# EAGLE design voiture TRR (EAGLE 6.1)
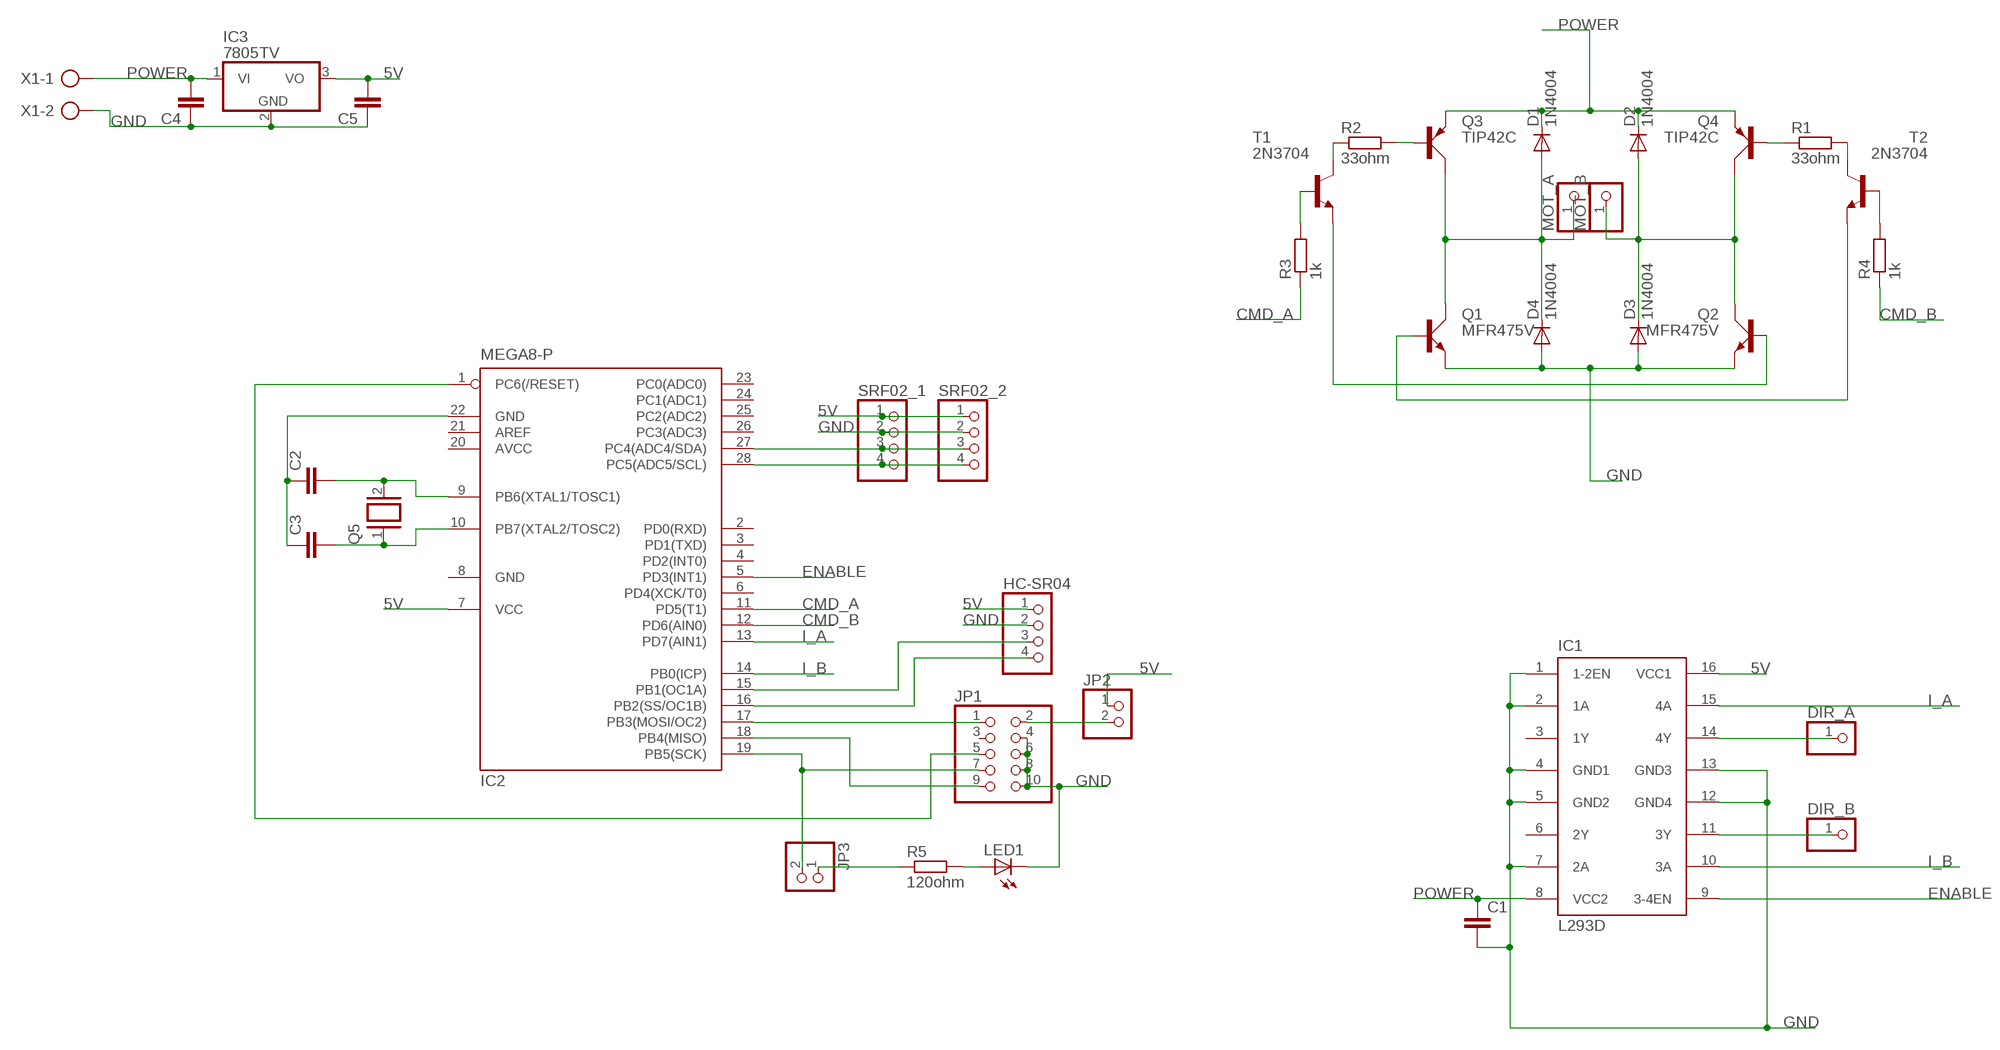
[diagram p0: schematic, sheet 1]

## Parts
C1  C-EU025-050X050  [C025-050X050]
C2  C5/2.5  [C5B2.5]
C3  C5/2.5  [C5B2.5]
C4  C5/2.5  [C5B2.5]
C5  C5/2.5  [C5B2.5]
D1  1N4004  [DO41-10]
D2  1N4004  [DO41-10]
D3  1N4004  [DO41-10]
D4  1N4004  [DO41-10]
DIR_A  PINHD-1X1  [1X01]
DIR_B  PINHD-1X1  [1X01]
HC-SR04  PINHD-1X4  [1X04]
IC1  L293D  [DIL16]
IC2  MEGA8-P  [DIL28-3]
IC3  7805TV  [TO220V]
JP1  PINHD-2X5  [2X05]
JP2  PINHD-1X2  [1X02]
JP3  PINHD-1X2  [1X02]
LED1  LED5MM  [LED5MM]
MOT_A  PINHD-1X1  [1X01]
MOT_B  PINHD-1X1  [1X01]
Q1  MFR475V  [TO220AV]
Q2  MFR475V  [TO220AV]
Q3  TIP42C  [TO220AV]
Q4  TIP42C  [TO220AV]
Q5  XTAL/S  [QS]
R1  33ohm  R-EU_0204/7  [0204/7]
R2  33ohm  R-EU_0204/7  [0204/7]
R3  1k  R-EU_0204/7  [0204/7]
R4  1k  R-EU_0204/7  [0204/7]
R5  120ohm  R-EU_0204/7  [0204/7]
SRF02_1  PINHD-1X4  [1X04]
SRF02_2  PINHD-1X4  [1X04]
T1  2N3704  [TO92]
T2  2N3704  [TO92]
X1  AK300/2  [AK300/2]

## Nets
5V: C5.2 HC-SR04.1 IC1.16(VCC1) IC2.7(VCC) IC3.3(VO) JP2.1 SRF02_1.1 SRF02_2.1
CMD_A: IC2.11(PD5(T1)) R3.1
CMD_B: IC2.12(PD6(AIN0)) R4.1
ENABLE: IC1.9(3-4EN) IC2.5(PD3(INT1))
GND: C1.2 C2.1 C3.1 C4.1 C5.1 D3.A D4.A HC-SR04.2 IC1.1(1-2EN) IC1.2(1A) IC1.4(GND1) IC1.5(GND2) IC1.7(2A) IC1.12(GND4) IC1.13(GND3) IC2.22(GND) IC3.2(GND) JP1.4 JP1.6 JP1.8 JP1.10 LED1.K(C) Q1.E Q2.E SRF02_1.2 SRF02_2.2 X1.2
I_A: IC1.15(4A) IC2.13(PD7(AIN1))
I_B: IC1.10(3A) IC2.14(PB0(ICP))
N$1: D1.A D4.C MOT_A.1 Q1.C Q3.C
N$2: Q3.B R2.2
N$3: DIR_A.1 IC1.14(4Y)
N$4: DIR_B.1 IC1.11(3Y)
N$5: R2.1 T1.2(C)
N$6: D2.A D3.C MOT_B.1 Q2.C Q4.C
N$7: Q2.B T1.3(E)
N$8: Q4.B R1.1
N$9: R1.2 T2.2(C)
N$10: Q1.B T2.3(E)
N$11: R4.2 T2.1(B)
N$12: R3.2 T1.1(B)
N$13: C3.2 IC2.10(PB7(XTAL2/TOSC2)) Q5.1
N$14: C2.2 IC2.9(PB6(XTAL1/TOSC1)) Q5.2
N$15: IC2.17(PB3(MOSI/OC2)) JP1.1
N$16: IC2.1(PC6(/RESET)) JP1.5
N$17: IC2.19(PB5(SCK)) JP1.7 JP3.2
N$18: IC2.18(PB4(MISO)) JP1.9
N$19: JP3.1 R5.1
N$20: JP1.2 JP2.2
N$21: LED1.A R5.2
N$22: IC2.27(PC4(ADC4/SDA)) SRF02_1.3 SRF02_2.3
N$23: IC2.28(PC5(ADC5/SCL)) SRF02_1.4 SRF02_2.4
N$24: HC-SR04.3 IC2.15(PB1(OC1A))
N$25: HC-SR04.4 IC2.16(PB2(SS/OC1B))
POWER: C1.1 C4.2 D1.C D2.C IC1.8(VCC2) IC3.1(VI) Q3.E Q4.E X1.1
Unconnected: IC1.3(1Y) IC1.6(2Y) IC2.2(PD0(RXD)) IC2.3(PD1(TXD)) IC2.4(PD2(INT0)) IC2.6(PD4(XCK/T0)) IC2.21(AREF) IC2.23(PC0(ADC0)) IC2.24(PC1(ADC1)) IC2.25(PC2(ADC2)) IC2.26(PC3(ADC3)) JP1.3

## Power pins joined to a net without a drawn wire
5V: IC2.20(AVCC)
GND: IC2.8(GND)

## Library data of the parts
C1 = rcl:C-EU: CAPACITOR, European symbol
C2-C5 = capacitor-wima:C: CAPACITOR naming: grid - package width
D1-D4 = diode:1N4004: DIODE general purpose rectifier, 1 A
DIR_A DIR_B MOT_A MOT_B = pinhead:PINHD-1X1: PIN HEADER
HC-SR04 SRF02_1 SRF02_2 = pinhead:PINHD-1X4: PIN HEADER
IC1 = st-microelectronics:L293D: PUSH-PULL 4 CHANNEL DRIVER; MPN: L293D; OC_FARNELL: 9589619; OC_NEWARK: 56P8249
IC2 = atmel:MEGA8-P: MICROCONTROLLER 8 Kbytes FLASH, 1 kbytes SRAM, 512 bytes EEPROM, USART, 4-channel 10 bit ADC, 2-channel 8 bit ADC Pin compatible with Atmega48, ATMega88, ATMega168 Source: avr.lbr; OC_FARNELL: unknown; OC_NEWARK: unknown
IC3 = linear:78*: Positive VOLTAGE REGULATOR Source: http://cache.national.com/ds/LM/LM78L05.pdf http://www.fairchildsemi.com/ds/LM/LM7805.pdf
JP1 = pinhead:PINHD-2X5: PIN HEADER
JP2 JP3 = pinhead:PINHD-1X2: PIN HEADER
LED1 = led:LED: LED OSRAM: - CHIPLED LG R971, LG N971, LY N971, LG Q971, LY Q971, LO R971, LY R971 LH N974, LH R974 LS Q976, LO Q976, LY Q976 LO Q996 - Hyper CHIPLED LW Q18S LB Q993, LB Q99A, LB R99A - SideLED LS A670, LO A670, LY A670, LG A670, LP A670 LB A673, LV A673, LT A673, LW A673 LH A674 LY A675 LS A676, LA A676, LO A676, LY A676, LW A676 LS A679, LY A679, LG A679 - Hyper Micro SIDELED® LS Y876, LA Y876, LO Y876, LY Y876 LT Y87S - SmartLED LW L88C, LW L88S LB L89C, LB L89S, LG L890 LS L89K, LO L89K, LY L89K LS L896, LA L896, LO L896, LY L896 - TOPLED LS T670, LO T670, LY T670, LG T670, LP T670 LSG T670, LSP T670, LSY T670, LOP T670, LYG T670 LG T671, LOG T671, LSG T671 LB T673, LV T673, LT T673, LW T673 LH T674 LS T676, LA T676, LO T676, LY T676, LB T676, LH T676, LSB T676, LW T676 LB T67C, LV T67C, LT T67C, LS T67K, LO T67K, LY T67K, LW E67C LS E67B, LA E67B, LO E67B, LY E67B, LB E67C, LV E67C, LT E67C LW T67C LS T679, LY T679, LG T679 LS T770, LO T770, LY T770, LG T770, LP T770 LB T773, LV T773, LT T773, LW T773 LH T774 LS E675, LA E675, LY E675, LS T675 LS T776, LA T776, LO T776, LY T776, LB T776 LHGB T686 LT T68C, LB T68C - Hyper Mini TOPLED® LB M676 - Mini TOPLED Santana® LG M470 LS M47K, LO M47K, LY M47K Source: http://www.osram.convergy.de LUXEON: - LUMILED® LXK2-PW12-R00, LXK2-PW12-S00, LXK2-PW14-U00, LXK2-PW14-V00 LXK2-PM12-R00, LXK2-PM12-S00, LXK2-PM14-U00 LXK2-PE12-Q00, LXK2-PE12-R00, LXK2-PE12-S00, LXK2-PE14-T00, LXK2-PE14-U00 LXK2-PB12-K00, LXK2-PB12-L00, LXK2-PB12-M00, LXK2-PB14-N00, LXK2-PB14-P00, LXK2-PB14-Q00 LXK2-PR12-L00, LXK2-PR12-M00, LXK2-PR14-Q00, LXK2-PR14-R00 LXK2-PD12-Q00, LXK2-PD12-R00, LXK2-PD12-S00 LXK2-PH12-R00, LXK2-PH12-S00 LXK2-PL12-P00, LXK2-PL12-Q00, LXK2-PL12-R00 Source: www.luxeon.com KINGBRIGHT: KA-3528ASYC Source: www.kingbright.com
Q1 Q2 = transistor-power:MFR4*: NPN RF Power Transistor Source: Motorola - MRF475.pdf
Q3 Q4 = transistor-power:TIP42C: PNP TRANSISTOR
Q5 = special:XTAL/S: CRYSTAL
R1-R5 = resistor:R-EU_: RESISTOR, European symbol
T1 T2 = transistor:2N3704: NPN TRANSISTOR
X1 = con-ptr500:AK300/2: CONNECTOR; OC_FARNELL: unknown; OC_NEWARK: unknown

## Board
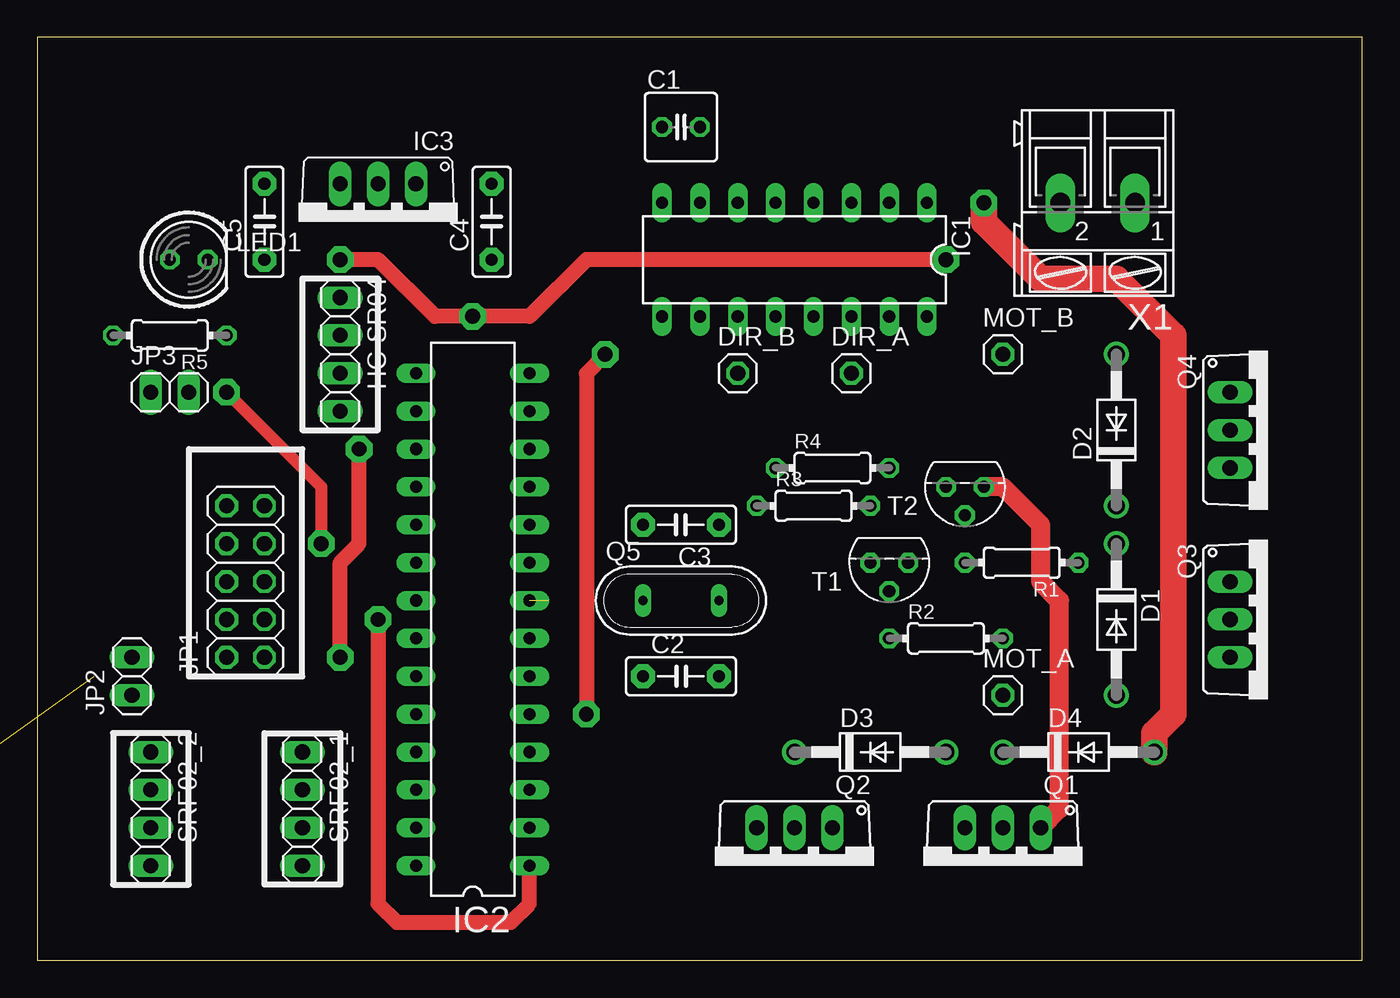
[diagram p1: board, top side]
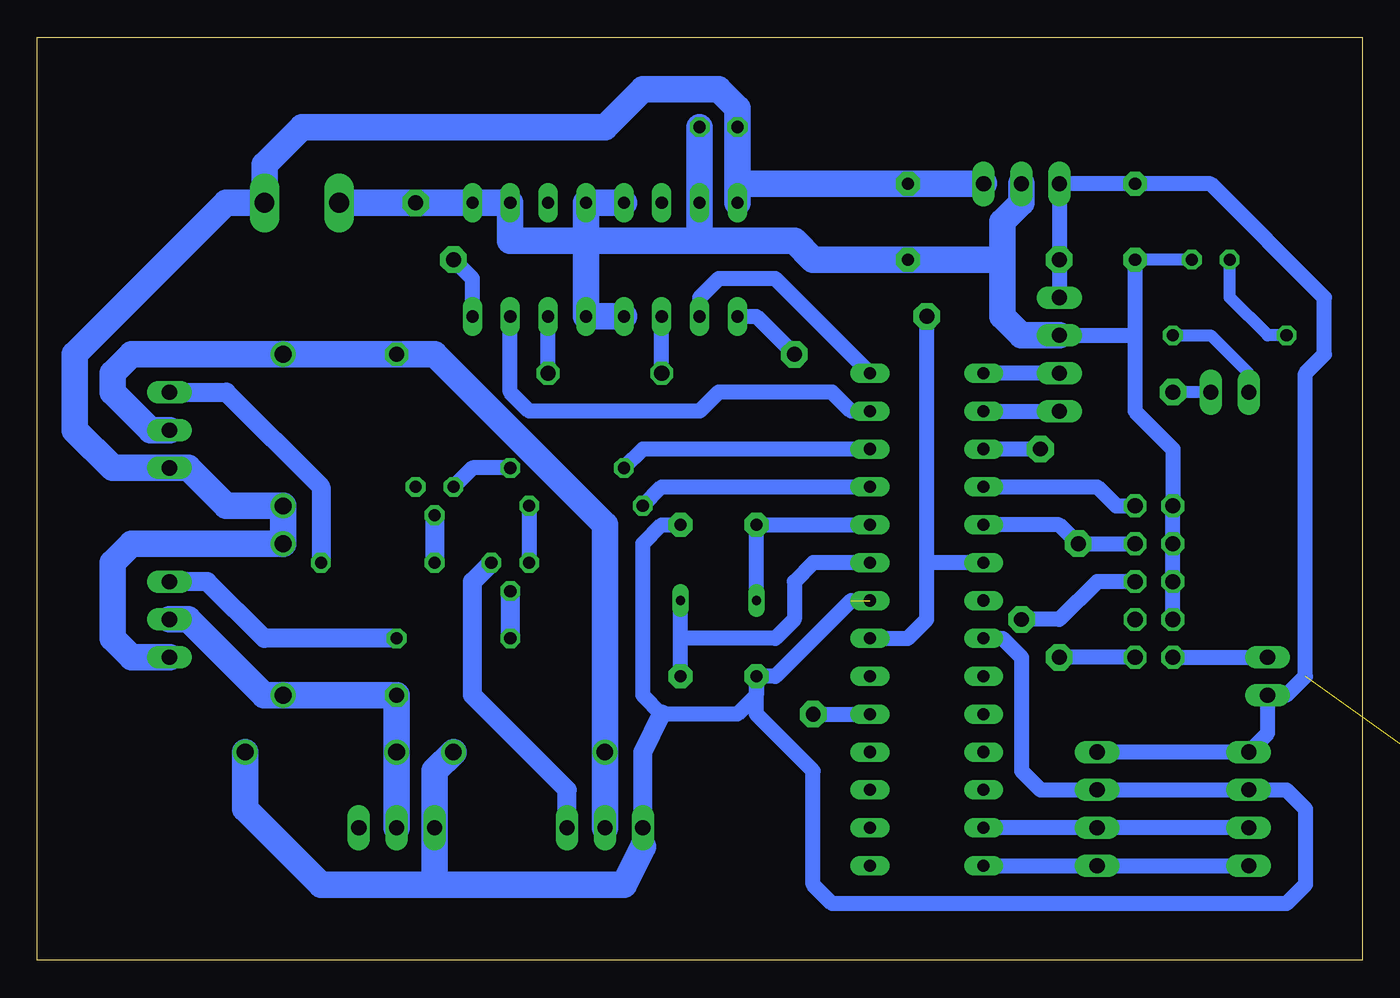
[diagram p2: board, bottom side, seen from below]

Size 88.88 x 61.9 mm. Coordinates in mm from the lower left corner, seen from the top.
Outline: 0,0 88.88,0 88.88,61.9 0,61.9 0,0
Copper layers (1*16): Top 0.035mm / dielectric 1.5mm / Bottom 0.035mm
Design rules: minimum track width 10mil, minimum drill 24mil, track to track 8mil, track to pad 8mil, pad to pad 8mil, via to via 8mil, smd to smd 8mil, copper to edge 40mil, drill to drill 8mil, minimum pad ring 10mil, minimum via ring 8mil, stop-mask expansion 4mil, vias tented up to drill 0mil, thermal gap 10mil

### Footprints (pad centres in the part's own frame; a part is rotated, then mirrored left to right if it is on the bottom)
C025-050X050 = drill 0.813 octagon: 1 -1.27,0; 2 1.27,0
C5B2.5 = drill 0.813 pad 1.6 octagon: 1 -2.54,0; 2 2.54,0
DO41-10 = drill 1.118: A 5.08,0; C -5.08,0
1X01 = drill 1.016 octagon: 1 0,0
1X04 = drill 1.016 long: 1 -3.81,0; 2 -1.27,0; 3 1.27,0; 4 3.81,0
DIL16 = drill 0.813 long: 1 -8.89,-3.81; 2 -6.35,-3.81; 3 -3.81,-3.81; 4 -1.27,-3.81; 5 1.27,-3.81; 6 3.81,-3.81; 7 6.35,-3.81; 8 8.89,-3.81; 9 8.89,3.81; 10 6.35,3.81; 11 3.81,3.81; 12 1.27,3.81; 13 -1.27,3.81; 14 -3.81,3.81; 15 -6.35,3.81; 16 -8.89,3.81
DIL28-3 = drill 0.813 long: 1 -16.51,-3.81; 2 -13.97,-3.81; 3 -11.43,-3.81; 4 -8.89,-3.81; 5 -6.35,-3.81; 6 -3.81,-3.81; 7 -1.27,-3.81; 8 1.27,-3.81; 9 3.81,-3.81; 10 6.35,-3.81; 11 8.89,-3.81; 12 11.43,-3.81; 13 13.97,-3.81; 14 16.51,-3.81; 15 16.51,3.81; 16 13.97,3.81; 17 11.43,3.81; 18 8.89,3.81; 19 6.35,3.81; 20 3.81,3.81; 21 1.27,3.81; 22 -1.27,3.81; 23 -3.81,3.81; 24 -6.35,3.81; 25 -8.89,3.81; 26 -11.43,3.81; 27 -13.97,3.81; 28 -16.51,3.81
TO220V = drill 1.016 long: 1 -2.54,-2.54; 2 0,-2.54; 3 2.54,-2.54
2X05 = drill 1.016 octagon: 1 -5.08,-1.27; 2 -5.08,1.27; 3 -2.54,-1.27; 4 -2.54,1.27; 5 0,-1.27; 6 0,1.27; 7 2.54,-1.27; 8 2.54,1.27; 9 5.08,-1.27; 10 5.08,1.27
1X02 = drill 1.016 long: 1 -1.27,0; 2 1.27,0
LED5MM = drill 0.813 octagon: A -1.27,0; K 1.27,0
TO220AV = drill 1.016 long: B -2.54,-2.54; C 0,-2.54; E 2.54,-2.54
QS = drill 0.61 long: 1 -2.54,0; 2 2.54,0
0204/7 = drill 0.813 octagon: 1 -3.81,0; 2 3.81,0
TO92 = drill 0.813 octagon: 1 1.27,0; 2 0,1.905; 3 -1.27,0
AK300/2 = drill 1.321 long: 1 -2.515,0; 2 2.489,0

### Placement (x,y rotation side)
C1  43.18,55.88 0 top
C2  43.18,19.05 0 top
C3  43.18,29.21 180 top
C4  30.48,49.53 90 top
C5  15.24,49.53 90 top
D1  72.39,22.86 270 top
D2  72.39,35.56 90 top
D3  55.88,13.97 0 top
D4  69.85,13.97 0 top
DIR_A  54.61,39.37 0 top
DIR_B  46.99,39.37 0 top
HC-SR04  20.32,40.64 270 top
IC1  50.8,46.99 180 top
IC2  29.21,22.86 90 top
IC3  22.86,49.53 180 top
JP1  13.97,25.4 90 top
JP2  6.35,19.05 90 top
JP3  8.89,38.1 0 top
LED1  10.16,46.99 0 top
MOT_A  64.77,17.78 0 top
MOT_B  64.77,40.64 0 top
Q1  64.77,6.35 180 top
Q2  50.8,6.35 180 top
Q3  82.55,22.86 270 top
Q4  82.55,35.56 270 top
Q5  43.18,24.13 0 top
R1  66.04,26.67 180 top
R2  60.96,21.59 0 top
R3  52.07,30.48 0 top
R4  53.34,33.02 0 top
R5  8.89,41.91 180 top
SRF02_1  17.78,10.16 270 top
SRF02_2  7.62,10.16 270 top
T1  57.15,26.67 180 top
T2  62.23,31.75 180 top
X1  71.12,50.8 180 top

### Tracks (layer width: path | path; a pad name or v marks a point on that pad's centre or on a via)
5V  (via drill 1 pad 1.78)  (1 unrouted)
  Top 1.016: v60.96,46.99 36.83,46.99 33.02,43.18 v29.21,43.18 26.67,43.18 22.86,46.99 v20.32,46.99
  Bottom 1.016: SRF02_1.1 SRF02_2.1 6.35,15.24 JP2.1 5.08,17.78 3.81,19.05 3.81,39.37 2.54,40.64 2.54,44.45 10.16,52.07 C5.2 IC3.3 v20.32,46.99 HC-SR04.1 | IC1.16 59.69,45.72 v60.96,46.99 | IC2.7 30.48,21.59 29.21,22.86 29.21,26.67 | 29.21,26.67 v29.21,43.18 | IC2.20 29.21,26.67
  other vias: -22.86,0
CMD_A
  Bottom 1.016: R3.1 46.99,31.75 IC2.11
CMD_B
  Bottom 1.016: IC2.12 48.26,34.29 R4.1
ENABLE  (via drill 1 pad 1.78)
  Top 1.016: v38.1,40.64 36.83,39.37 v36.83,16.51
  Bottom 1.016: IC1.9 40.64,43.18 v38.1,40.64 | v36.83,16.51 IC2.5
GND  (via drill 1 pad 1.78)  (1 unrouted)
  Top 1.778: D4.A 74.93,15.24 76.2,16.51 76.2,41.91 72.39,45.72 67.31,45.72 63.5,49.53 v63.5,50.8
  Bottom 0.813: LED1.K C5.1
  Bottom 1.016: 34.29,24.13 39.37,19.05 C2.1 | JP1.4 JP1.6 JP1.8 JP1.10 12.7,34.29 15.24,36.83 15.24,41.91 | C5.1 15.24,41.91 | HC-SR04.2 15.24,41.91 | IC2.22 24.13,21.59 22.86,20.32 22.86,12.7 21.59,11.43 SRF02_1.2 SRF02_2.2 5.08,11.43 3.81,10.16 3.81,5.08 5.08,3.81 35.56,3.81 36.83,5.08 36.83,12.7 40.64,16.51 C2.1 | C2.1 40.64,17.78 41.91,16.51 46.99,16.51 48.26,17.78 48.26,27.94 46.99,29.21 C3.1
  Bottom 1.27: 48.26,7.62 Q2.E 48.26,13.97 46.99,16.51
  Bottom 1.778: IC1.12 IC1.13 52.07,48.26 | 52.07,48.26 IC1.4 IC1.5 | 52.07,48.26 57.15,48.26 IC1.2 IC1.1 v63.5,50.8 X1.2 | 44.45,48.26 IC1.7 C1.2 | 44.45,48.26 52.07,48.26 | IC3.2 22.86,50.8 24.13,49.53 24.13,46.99 | 24.13,46.99 24.13,43.18 22.86,41.91 HC-SR04.2 | 24.13,46.99 C4.1 36.83,46.99 38.1,48.26 44.45,48.26 | D3.A 62.23,12.7 Q1.E 62.23,5.08 | 62.23,5.08 69.85,5.08 74.93,10.16 D4.A | 62.23,5.08 49.53,5.08 48.26,7.62
I_A
  Bottom 1.016: IC2.13 34.29,36.83 35.56,38.1 43.18,38.1 44.45,36.83 55.88,36.83 57.15,38.1 IC1.15
I_B
  Bottom 1.016: IC2.14 39.37,45.72 43.18,45.72 44.45,44.45 IC1.10
N$1
  Bottom 1.778: Q1.C D4.C MOT_A.1 D1.A 73.66,17.78 78.74,22.86 Q3.C
N$2
  Bottom 1.27: R2.2 73.66,21.59 77.47,25.4 Q3.B
N$3
  Bottom 1.016: DIR_A.1 IC1.14
N$4
  Bottom 1.016: DIR_B.1 IC1.11
N$5
  Bottom 1.27: T1.2 R2.1
N$6
  Bottom 1.778: Q2.C D3.C 50.8,29.21 62.23,40.64 MOT_B.1 D2.A 82.55,40.64 83.82,39.37 83.82,38.1 81.28,35.56 Q4.C
N$7
  Bottom 1.27: Q2.B 53.34,11.43 59.69,17.78 59.69,25.4 T1.3
N$8
  Bottom 1.27: Q4.B 76.2,38.1 69.85,31.75 R1.1
N$9
  Bottom 1.27: T2.2 R1.2
N$10
  Top 1.27: Q1.B 68.58,10.16 68.58,24.13 67.31,25.4 67.31,29.21 64.77,31.75 T2.3
N$11
  Bottom 1.016: R4.2 59.69,33.02 T2.1
N$12
  Bottom 1.016: R3.2 T1.1
N$13
  Bottom 1.016: Q5.1 C3.2 IC2.10
N$14
  Bottom 1.016: C2.2 45.72,21.59 | 45.72,21.59 Q5.2 | IC2.9 36.83,26.67 38.1,25.4 38.1,22.86 39.37,21.59 45.72,21.59
N$15  (via drill 1 pad 1.78)
  Top 1.016: v20.32,20.32 20.32,26.67 21.59,27.94 v21.59,34.29
  Bottom 1.016: JP1.1 v20.32,20.32 | v21.59,34.29 IC2.17
N$16  (via drill 1 pad 1.78)
  Top 1.016: v22.86,22.86 22.86,3.81 24.13,2.54 31.75,2.54 33.02,3.81 IC2.1
  Bottom 1.016: JP1.5 17.78,25.4 20.32,22.86 v22.86,22.86
N$17  (via drill 1 pad 1.78)
  Top 0.813: v12.7,38.1 19.05,31.75 v19.05,27.94
  Bottom 0.813: JP3.2 v12.7,38.1
  Bottom 1.016: IC2.19 20.32,29.21 v19.05,27.94 JP1.7
N$18
  Bottom 1.016: IC2.18 17.78,31.75 16.51,30.48 JP1.9
N$19
  Bottom 0.813: R5.1 10.16,41.91 7.62,39.37 JP3.1
N$20
  Bottom 1.016: JP1.2 JP2.2
N$21
  Bottom 0.813: R5.2 6.35,41.91 8.89,44.45 LED1.A
N$22
  Bottom 1.016: SRF02_2.3 SRF02_1.3 IC2.27
N$23
  Bottom 1.016: IC2.28 SRF02_1.4 SRF02_2.4
N$24
  Bottom 1.016: HC-SR04.3 IC2.15
N$25
  Bottom 1.016: IC2.16 HC-SR04.4
POWER
  Bottom 1.778: 41.91,52.07 C1.1 41.91,57.15 43.18,58.42 48.26,58.42 50.8,55.88 71.12,55.88 73.64,53.37 X1.1 76.2,50.8 86.36,40.64 86.36,35.56 83.82,33.02 Q4.E 78.74,33.02 76.2,30.48 D2.C D1.C 82.55,27.94 83.82,26.67 83.82,21.59 82.55,20.32 Q3.E | 41.91,52.07 IC1.8 | 25.38,52.09 IC3.1 C4.2 41.91,52.07